# Altium schematic sheet RFFE-Supply-v2.SchDoc
size A3; SheetNumber: 3; SheetTotal: 3
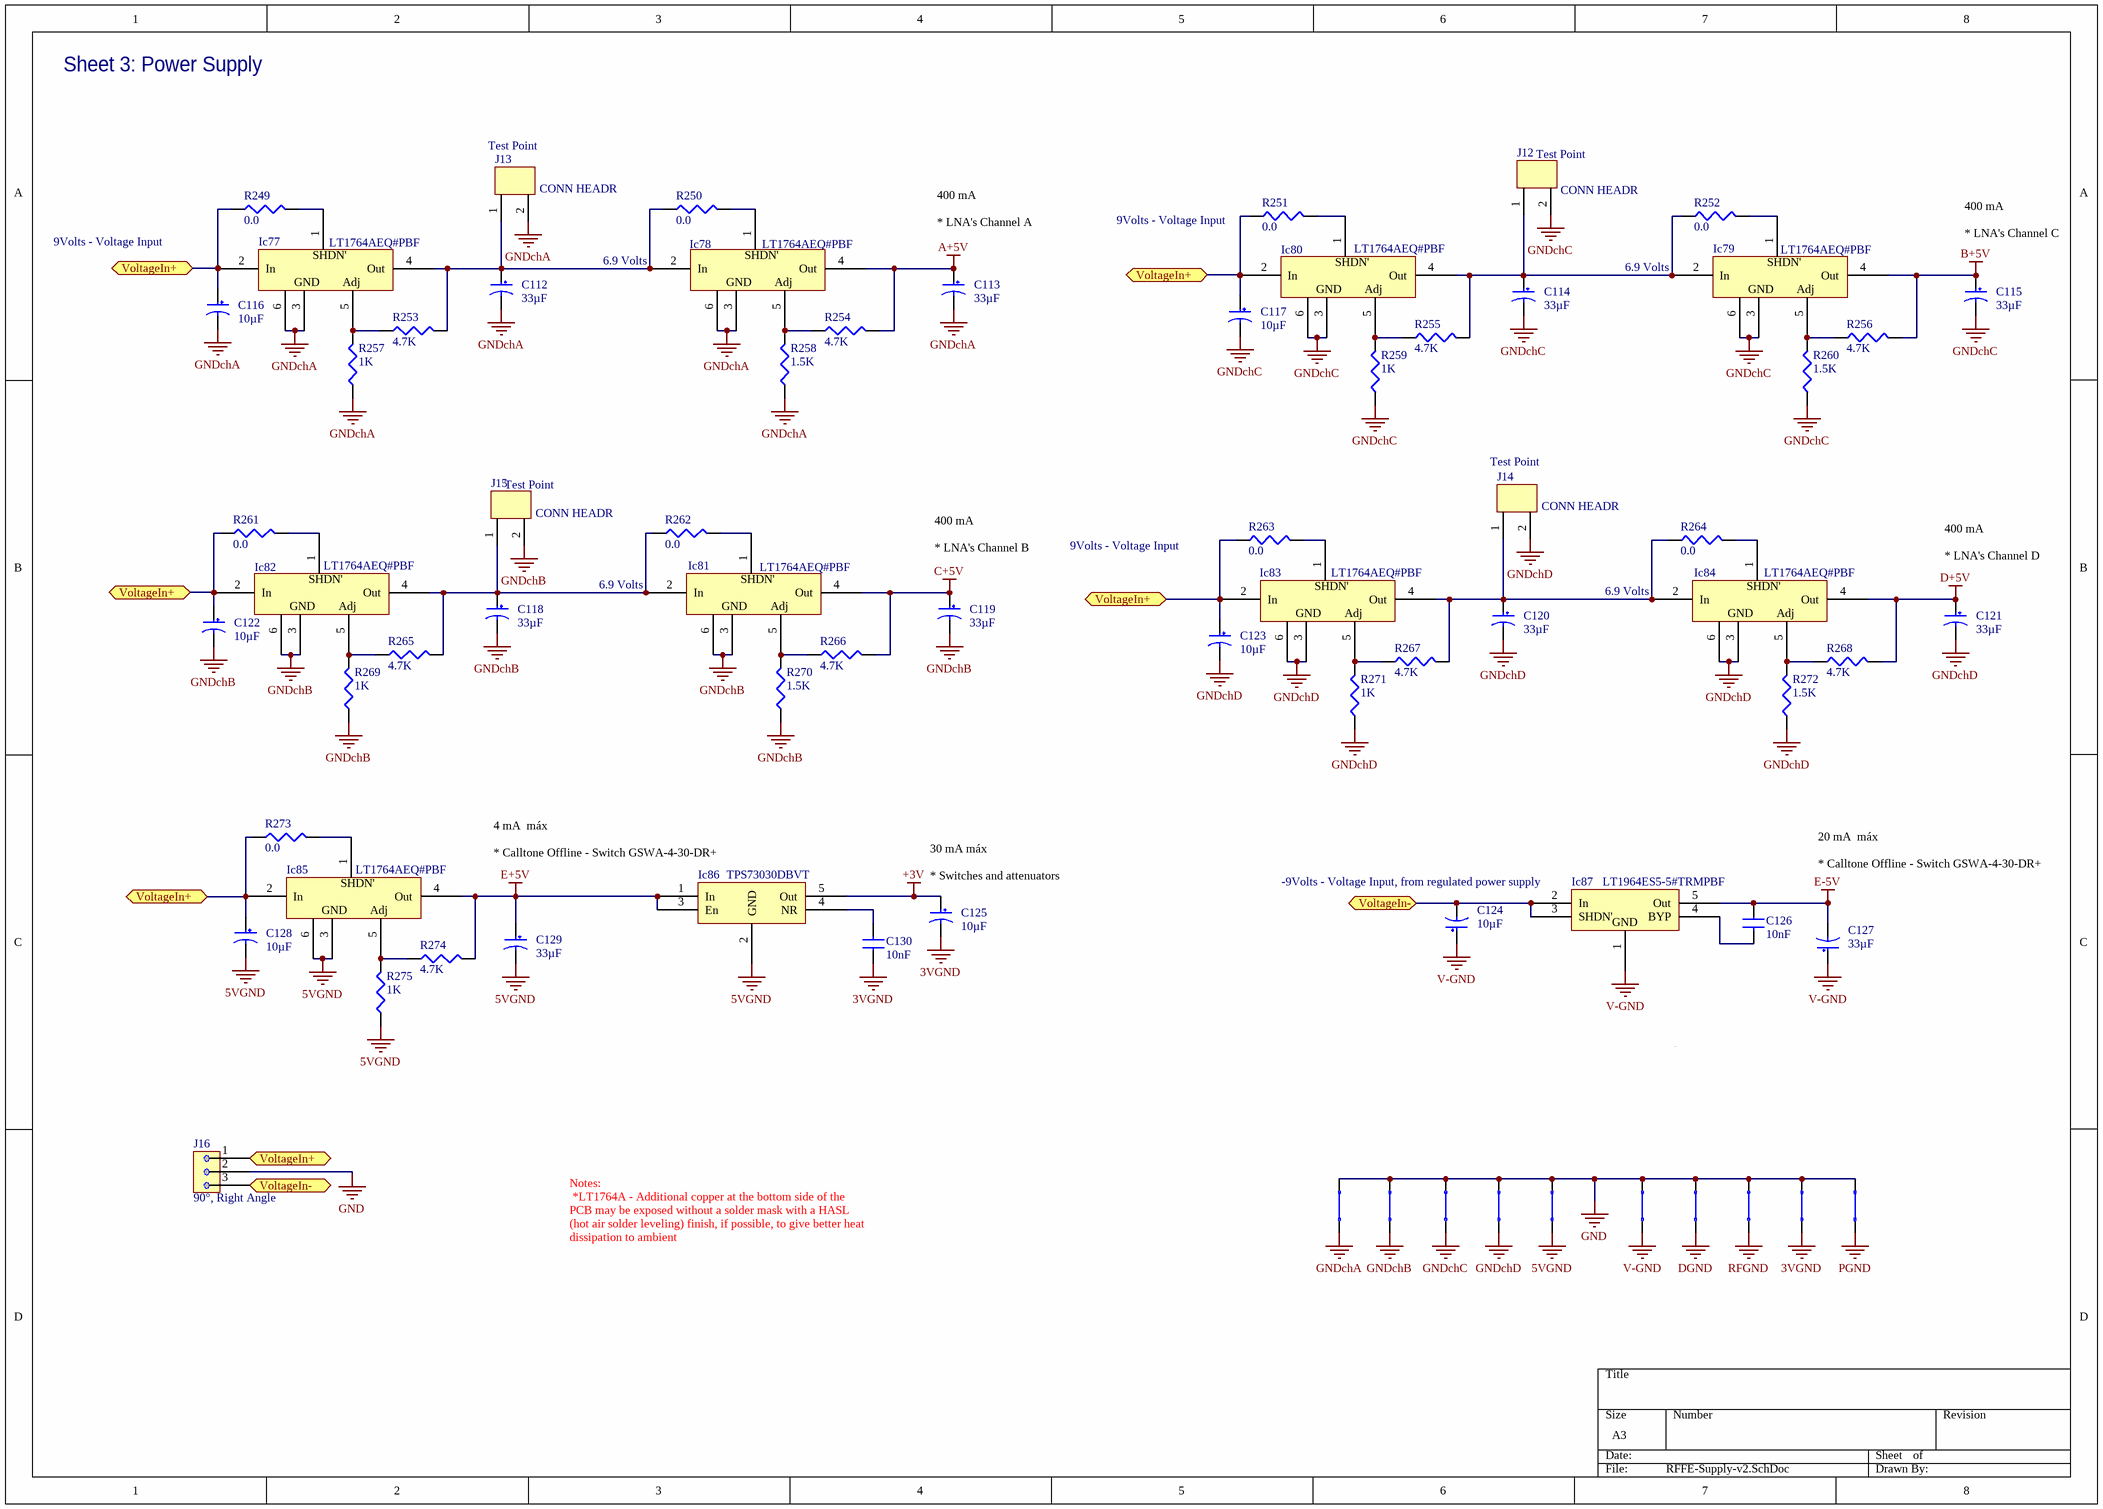
[diagram p0: RFFE-Supply-v2.SchDoc]

## Parts
C112  Capacitance: 33µF  [TC7343-2917]  (hidden comment: CAP TANT 33UF)
C113  Capacitance: 33µF  [TC7343-2917]  (hidden comment: CAP TANT 33UF)
C114  Capacitance: 33µF  [TC7343-2917]  (hidden comment: CAP TANT 33UF)
C115  Capacitance: 33µF  [TC7343-2917]  (hidden comment: CAP TANT 33UF)
C116  Capacitance: 10µF  [TC3528-1411]  (hidden comment: CAP TANT 10UF)
C117  Capacitance: 10µF  [TC3528-1411]  (hidden comment: CAP TANT 10UF)
C118  Capacitance: 33µF  [TC7343-2917]  (hidden comment: CAP TANT 33UF)
C119  Capacitance: 33µF  [TC7343-2917]  (hidden comment: CAP TANT 33UF)
C120  Capacitance: 33µF  [TC7343-2917]  (hidden comment: CAP TANT 33UF)
C121  Capacitance: 33µF  [TC7343-2917]  (hidden comment: CAP TANT 33UF)
C122  Capacitance: 10µF  [TC3528-1411]  (hidden comment: CAP TANT 10UF)
C123  Capacitance: 10µF  [TC3528-1411]  (hidden comment: CAP TANT 10UF)
C124  Capacitance: 10µF  [TC3528-1411]  (hidden comment: CAP TANT 10UF)
C125  Capacitance: 10µF  [TC3528-1411]  (hidden comment: CAP TANT 10UF)
C126  Capacitance: 10nF  [CAPC2012M]  (hidden comment: CAP CER 10000PF)
C127  Capacitance: 33µF  [TC7343-2917]  (hidden comment: CAP TANT 33UF)
C128  Capacitance: 10µF  [TC3528-1411]  (hidden comment: CAP TANT 10UF)
C129  Capacitance: 33µF  [TC7343-2917]  (hidden comment: CAP TANT 33UF)
C130  Capacitance: 10nF  [CAPC2012M]  (hidden comment: CAP CER 10000PF)
Ic77  IC LDO LO NOISE 3A ADJ DDPAK-5  [DD Pak]  (value not drawn)
Ic78  IC LDO LO NOISE 3A ADJ DDPAK-5  [DD Pak]  (value not drawn)
Ic79  IC LDO LO NOISE 3A ADJ DDPAK-5  [DD Pak]  (value not drawn)
Ic80  IC LDO LO NOISE 3A ADJ DDPAK-5  [DD Pak]  (value not drawn)
Ic81  IC LDO LO NOISE 3A ADJ DDPAK-5  [DD Pak]  (value not drawn)
Ic82  IC LDO LO NOISE 3A ADJ DDPAK-5  [DD Pak]  (value not drawn)
Ic83  IC LDO LO NOISE 3A ADJ DDPAK-5  [DD Pak]  (value not drawn)
Ic84  IC LDO LO NOISE 3A ADJ DDPAK-5  [DD Pak]  (value not drawn)
Ic85  IC LDO LO NOISE 3A ADJ DDPAK-5  [DD Pak]  (value not drawn)
Ic86  TPS73030DBVT  [DBV005]
Ic87  LT1964ES5-5#TRMPBF  [TSOT-23]
J12  CONN HEADR  [HDR1X2Ha]
J13  CONN HEADR  [HDR1X2H]
J14  CONN HEADR  [HDR1X2H]
J15  CONN HEADR  [HDR1X2H]
J16  Header Orientation: 90°, Right Angle  [Axial3]  (hidden comment: 1881451)
Jmp1  Jumper  [StrGND]  (value not drawn)
Jmp2  Jumper  [StrGND]  (value not drawn)
Jmp3  Jumper  [StrGND]  (value not drawn)
Jmp4  Jumper  [StrGND]  (value not drawn)
Jmp5  Jumper  [StrGND]  (value not drawn)
Jmp6  Jumper  [StrGND]  (value not drawn)
Jmp7  Jumper  [StrGND]  (value not drawn)
Jmp8  Jumper  [StrGND]  (value not drawn)
Jmp9  Jumper  [StrGND]  (value not drawn)
Jmp10  Jumper  [StrGND]  (value not drawn)
R249  Resistance (Ohms): 0.0  [CAPC1608N]  (hidden comment: ERJ-3GEY0R00V)
R250  Resistance (Ohms): 0.0  [CAPC1608N]  (hidden comment: ERJ-3GEY0R00V)
R251  Resistance (Ohms): 0.0  [CAPC1608N]  (hidden comment: ERJ-3GEY0R00V)
R252  Resistance (Ohms): 0.0  [CAPC1608N]  (hidden comment: ERJ-3GEY0R00V)
R253  Resistance (Ohms): 4.7K  [RESC2012N]  (hidden comment: RES 4.7K)
R254  Resistance (Ohms): 4.7K  [RESC2012N]  (hidden comment: RES 4.7K)
R255  Resistance (Ohms): 4.7K  [RESC2012N]  (hidden comment: RES 4.7K)
R256  Resistance (Ohms): 4.7K  [RESC2012N]  (hidden comment: RES 4.7K)
R257  Resistance (Ohms): 1K  [RESC2012M]  (hidden comment: RES 1.0K)
R258  Resistance (Ohms): 1.5K  [RESC2012M]  (hidden comment: RES 1.5K)
R259  Resistance (Ohms): 1K  [RESC2012M]  (hidden comment: RES 1.0K)
R260  Resistance (Ohms): 1.5K  [RESC2012M]  (hidden comment: RES 1.5K)
R261  Resistance (Ohms): 0.0  [CAPC1608N]  (hidden comment: ERJ-3GEY0R00V)
R262  Resistance (Ohms): 0.0  [CAPC1608N]  (hidden comment: ERJ-3GEY0R00V)
R263  Resistance (Ohms): 0.0  [CAPC1608N]  (hidden comment: ERJ-3GEY0R00V)
R264  Resistance (Ohms): 0.0  [CAPC1608N]  (hidden comment: ERJ-3GEY0R00V)
R265  Resistance (Ohms): 4.7K  [RESC2012N]  (hidden comment: RES 4.7K)
R266  Resistance (Ohms): 4.7K  [RESC2012N]  (hidden comment: RES 4.7K)
R267  Resistance (Ohms): 4.7K  [RESC2012N]  (hidden comment: RES 4.7K)
R268  Resistance (Ohms): 4.7K  [RESC2012N]  (hidden comment: RES 4.7K)
R269  Resistance (Ohms): 1K  [RESC2012M]  (hidden comment: RES 1.0K)
R270  Resistance (Ohms): 1.5K  [RESC2012M]  (hidden comment: RES 1.5K)
R271  Resistance (Ohms): 1K  [RESC2012M]  (hidden comment: RES 1.0K)
R272  Resistance (Ohms): 1.5K  [RESC2012M]  (hidden comment: RES 1.5K)
R273  Resistance (Ohms): 0.0  [CAPC1608N]  (hidden comment: ERJ-3GEY0R00V)
R274  Resistance (Ohms): 4.7K  [RESC2012N]  (hidden comment: RES 4.7K)
R275  Resistance (Ohms): 1K  [RESC2012M]  (hidden comment: RES 1.0K)

## Ports
VoltageIn+, VoltageIn-

## Nets
3VGND: C125.2 C130.2 Jmp7.1
5VGND: C128.2 C129.2 Ic85.3(GND) Ic85.6(GND) Ic86.2(GND) Jmp3.1 R275.2
+3V: C125.1 Ic86.5(Out)
A+5V: C113.1 Ic78.4(Out) R254.1
B+5V: C115.1 Ic79.4(Out) R256.1
C+5V: C119.1 Ic81.4(Out) R266.1
D+5V: C121.1 Ic84.4(Out) R268.1
DGND: Jmp5.1
E+5V: C129.1 Ic85.4(Out) Ic86.1(In) Ic86.3(En) R274.1
E-5V: C126.1 C127.2 Ic87.5(Out)
GND: J16.2(P2) Jmp1.2 Jmp2.2 Jmp3.2 Jmp4.2 Jmp5.2 Jmp6.2 Jmp7.2 Jmp8.2 Jmp9.2 Jmp10.2
GNDchA: C112.2 C113.2 C116.2 Ic77.3(GND) Ic77.6(GND) Ic78.3(GND) Ic78.6(GND) J13.2 Jmp9.1 R257.2 R258.2
GNDchB: C118.2 C119.2 C122.2 Ic81.3(GND) Ic81.6(GND) Ic82.3(GND) Ic82.6(GND) J15.2 Jmp10.1 R269.2 R270.2
GNDchC: C114.2 C115.2 C117.2 Ic79.3(GND) Ic79.6(GND) Ic80.3(GND) Ic80.6(GND) J12.2 Jmp1.1 R259.2 R260.2
GNDchD: C120.2 C121.2 C123.2 Ic83.3(GND) Ic83.6(GND) Ic84.3(GND) Ic84.6(GND) J14.2 Jmp2.1 R271.2 R272.2
PGND: Jmp8.1
RFGND: Jmp6.1
V-GND: C124.1 C127.1 Ic87.1(GND) Jmp4.1
VoltageIn+: C116.1 C117.1 C122.1 C123.1 C128.1 Ic77.2(In) Ic80.2(In) Ic82.2(In) Ic83.2(In) Ic85.2(In) J16.1(P1) R249.2 R251.2 R261.2 R263.2 R273.2 ; port VoltageIn+
VoltageIn-: C124.2 Ic87.2(In) Ic87.3(SHDN') J16.3(P3) ; port VoltageIn-
NetC112_1: C112.1 Ic77.4(Out) Ic78.2(In) J13.1 R250.2 R253.1
NetC114_1: C114.1 Ic79.2(In) Ic80.4(Out) J12.1 R252.2 R255.1
NetC118_1: C118.1 Ic81.2(In) Ic82.4(Out) J15.1 R262.2 R265.1
NetC120_1: C120.1 Ic83.4(Out) Ic84.2(In) J14.1 R264.2 R267.1
NetC126_2: C126.2 Ic87.4(BYP)
NetC130_1: C130.1 Ic86.4(NR)
NetIc77_1: Ic77.1(SHDN) R249.1
NetIc77_5: Ic77.5(Adj) R253.2 R257.1
NetIc78_1: Ic78.1(SHDN) R250.1
NetIc78_5: Ic78.5(Adj) R254.2 R258.1
NetIc79_1: Ic79.1(SHDN) R252.1
NetIc79_5: Ic79.5(Adj) R256.2 R260.1
NetIc80_1: Ic80.1(SHDN) R251.1
NetIc80_5: Ic80.5(Adj) R255.2 R259.1
NetIc81_1: Ic81.1(SHDN) R262.1
NetIc81_5: Ic81.5(Adj) R266.2 R270.1
NetIc82_1: Ic82.1(SHDN) R261.1
NetIc82_5: Ic82.5(Adj) R265.2 R269.1
NetIc83_1: Ic83.1(SHDN) R263.1
NetIc83_5: Ic83.5(Adj) R267.2 R271.1
NetIc84_1: Ic84.1(SHDN) R264.1
NetIc84_5: Ic84.5(Adj) R268.2 R272.1
NetIc85_1: Ic85.1(SHDN) R273.1
NetIc85_5: Ic85.5(Adj) R274.2 R275.1

## Notes on the sheet
- Sheet 3: Power Supply
- (near J13) Test Point
- (near J12) Test Point
- 9Volts - Voltage Input
- (near C113) 400 mA
  * LNA's Channel A
- (near R251) 9Volts - Voltage Input
- (near C115) 400 mA
  * LNA's Channel C
- 6.9 Volts
- (near J15) Test Point
- (near J14) Test Point
- (near C119) 400 mA
  * LNA's Channel B
- (near C121) 400 mA
  * LNA's Channel D
- (near Ic86) 4 mA  máx
  * Calltone Offline - Switch GSWA-4-30-DR+
- (near C125) 30 mA máx
  * Switches and attenuators
- (near Ic87) -9Volts - Voltage Input, from regulated power supply
- 20 mA  máx
  * Calltone Offline - Switch GSWA-4-30-DR+
- Notes:
  *LT1764A - Additional copper at the bottom side of the PCB may be exposed without a solder mask with a HASL (hot air solder leveling) finish, if possible, to give better heat dissipation to ambient
- (in symbol LT1764AEQ#PBF) SHDN'

## Library data of the parts
C112-C115 C118-C121 C127 C129 = T495D336K016ATE150: CAP TANT 33UF 16V 10% 2917; Manufacturer: Kemet; Manufacturer Size Code: D; ESR (Equivalent Series Resistance): 150.0 mOhm; Type: Molded; Supplier 1: Digi-Key; Manufacturer Part Number: T495D336K016ATE150; RoHS: RoHS Compliant; Category: Capacitors; Stock 1: 9591; Pricing 1: 1=2.12, 10=1.735, 25=1.566, 100=1.3966, 250=1.22728 (USD); Voltage - Rated: 16V; Tolerance: ±10%; Operating Temperature: -55°C ~ 125°C; Mounting Type: Surface Mount; Package / Case: 2917 (7343 Metric); Size / Dimension: 0.287" L x 0.169" W (7.30mm x 4.30mm); Height - Seated (Max): 0.122" (3.10mm); Lead Spacing: -; Features: General Purpose; Packaging: Cut Tape (CT); Lifetime @ Temp.: -; ComponentLink1URL: http://www.kemet.com/datasheets&T495D336K016ATE150; ComponentLink1Description: http://www.kemet.com/datasheets&T495D336K016ATE150; Supplier Part Number 1: 399-4702-1-ND
C116 C117 C122-C125 C128 = T520B106M016ATE100: CAP TANT 10UF 16V 20% 1411; Manufacturer: Kemet; Manufacturer Size Code: B; ESR (Equivalent Series Resistance): 100.0 mOhm; Type: Molded; Supplier 1: Digi-Key; Manufacturer Part Number: T520B106M016ATE100; RoHS: RoHS Compliant; Category: Capacitors; Stock 1: 209; Pricing 1: 1=1.5, 10=1.23, 25=1.11, 100=0.99, 250=0.87, 500=0.81, 1000=0.63 (USD); Voltage - Rated: 16V; Tolerance: ±20%; Operating Temperature: -55°C ~ 105°C; Mounting Type: Surface Mount; Package / Case: 1411 (3528 Metric); Size / Dimension: 0.138" L x 0.110" W (3.50mm x 2.80mm); Height - Seated (Max): 0.083" (2.10mm); Lead Spacing: -; Features: Polymer; Packaging: Cut Tape (CT); Lifetime @ Temp.: -; ComponentLink1URL: http://www.kemet.com/datasheets&T520B106M016ATE100; ComponentLink1Description: http://www.kemet.com/datasheets&T520B106M016ATE100; Supplier Part Number 1: 399-5483-1-ND
C126 C130 = C2012C0G1H103J/0.60: CAP CER 10000PF 50V 5% NP0 0805; Manufacturer: TDK Corporation; Temperature Coefficient: C0G, NP0; Supplier 1: Digi-Key; Manufacturer Part Number: C2012C0G1H103J/0.60; RoHS: RoHS Compliant; Category: Capacitors; Stock 1: 7053; Pricing 1: 1=0.46, 10=0.363, 100=0.1898, 250=0.14024, 500=0.1089, 1000=0.0858 (USD); Voltage - Rated: 50V; Tolerance: ±5%; Mounting Type: Surface Mount, MLCC; Operating Temperature: -55°C ~ 125°C; Applications: General Purpose; Ratings: -; Package / Case: 0805 (2012 Metric); Size / Dimension: 0.079" L x 0.049" W (2.00mm x 1.25mm); Height - Seated (Max): -; Thickness (Max): 0.028" (0.70mm); Lead Spacing: -; Features: -; Packaging: Cut Tape (CT); Lead Style: -; ComponentLink1URL: http://www.tdk.com/pdf/general_B11.pdf; ComponentLink1Description: http://www.tdk.com/pdf/general_B11.pdf; Supplier Part Number 1: 445-7519-1-ND
Ic77-Ic85 = LT1764AEQ#PBF: Manufacturer: Linear Technology; Regulator Topology: Positive Adjustable; Voltage - Output: 1.21 V ~ 20 V; Voltage - Input: 2.7 V ~ 20 V; Voltage - Dropout (Typical): 0.34V @ 3A; Number of Regulators: 1; Current - Limit (Min): 3.1A; Supplier 1: Digi-Key; RoHS: RoHS Compliant; Description: IC LDO LO NOISE 3A ADJ DDPAK-5; Category: Integrated Circuits (ICs); Stock 1: 4102; Pricing 1: 1=7.38, 25=5.09, 100=4.19 (USD); Current - Output: 3A; Operating Temperature: -40°C ~ 125°C; Mounting Type: Surface Mount; Package / Case: TO-263-6, D²Pak (5 Leads + Tab), TO-263BA; Supplier Device Package: D2PAK-5; Packaging: Tube; ComponentLink1URL: http://www.linear.com/docs/1316; ComponentLink1Description: http://www.linear.com/docs/1316; Supplier Part Number 1: LT1764AEQ#PBF-ND; Manufacturer Part Number: LT1764AEQ#PBF
Ic86 = TPS73030DBVT: IC LDO REG HI-PSRR 3V SOT23-5; Manufacturer: Texas Instruments; Regulator Topology: Positive Fixed; Voltage - Input: Up to 5.5V; Voltage - Dropout (Typical): 0.12V @ 200mA; Number of Regulators: 1; Current - Output: 200mA (Max); Current - Limit (Min): 285mA; Supplier 1: Digi-Key; RoHS: RoHS Compliant; Category: Integrated Circuits (ICs); Stock 1: 572; Pricing 1: 1=0.84, 10=0.733, 25=0.6476, 100=0.5643 (USD); Voltage - Output: 3V; Operating Temperature: -40°C ~ 125°C; Mounting Type: Surface Mount; Package / Case: SC-74A, SOT-753; Supplier Device Package: SOT-23-5; Packaging: Cut Tape (CT); ComponentLink1URL: http://www.ti.com/lit/ds/symlink/tps73001.pdf; ComponentLink1Description: http://www.ti.com/lit/ds/symlink/tps73001.pdf; Supplier Part Number 1: 296-17579-1-ND; Manufacturer Part Number: TPS73030DBVT
Ic87 = LT1964ES5-5#TRMPBF: IC LDO REG NEG LOWNOISE TSOT23-5; Manufacturer: Linear Technology; Regulator Topology: Negative Fixed; Voltage - Output: -5V; Voltage - Input: Up to 20V; Voltage - Dropout (Typical): 0.34V @ 200mA; Number of Regulators: 1; Current - Output: 200mA; Current - Limit (Min): 220mA; Supplier 1: Digi-Key; RoHS: RoHS Compliant; Category: Integrated Circuits (ICs); Stock 1: 5556; Pricing 1: 1=3.25, 25=2.9, 100=2.61 (USD); Operating Temperature: -40°C ~ 125°C; Mounting Type: Surface Mount; Package / Case: SOT-23-5 Thin, TSOT-23-5; Supplier Device Package: TSOT-23-5; Packaging: Cut Tape (CT); ComponentLink1URL: http://www.linear.com/docs/1258; ComponentLink1Description: http://www.linear.com/docs/1258; Supplier Part Number 1: LT1964ES5-5#TRMPBFCT-ND; Manufacturer Part Number: LT1964ES5-5#TRMPBF
J12-J15 = 4-103321-4: CONN HEADR BRKWAY .100 2POS STR; Manufacturer: TE Connectivity; Connector Type: Header, Unshrouded, Breakaway; Number of Positions: 2; Number of Positions Loaded: All; Pitch: 0.100" (2.54mm); Supplier 1: Digi-Key; Manufacturer Part Number: 4-103321-4; RoHS: RoHS non-compliant; Category: Connectors, Interconnects; Stock 1: 0; Pricing 1: 20000=0.07434 (USD); Contact Type: Male Pin; Number of Rows: 1; Row Spacing: -; Contact Mating Length: 0.318" (8.08mm); Mounting Type: Through Hole; Termination: Solder; Fastening Type: -; Features: -; Contact Finish: Tin; Contact Finish Thickness: 100µin (2.54µm); Color: Black; Packaging: Bulk; ComponentLink1URL: http://documents.tycoelectronics.com/commerce/DocumentDelivery/DDEController?Action=srchrtrv&DocNm=103321&DocType=CD&DocLang=EN; ComponentLink1Description: http://documents.tycoelectronics.com/commerce/DocumentDelivery/DDEController?Action=srchrtrv&DocNm=103321&DocType=CD&DocLang=EN; Supplier Part Number 1: 4-103321-4-ND
J16 = 1881451: CONN TERM BLK HDR 2.5MM 3POS; Manufacturer: Phoenix Contact; Positions Per Level: 3; Pitch: 0.098" (2.50mm); Number of Levels: 1; Current: 4A; Voltage: 125V; Supplier 1: Digi-Key; Manufacturer Part Number: 1881451; RoHS: RoHS Compliant; Category: Connectors, Interconnects; Stock 1: 691; Pricing 1: 1=1.13, 10=1.098, 50=1.026, 100=0.9439, 250=0.87212, 500=0.83106, 1000=0.77976 (USD); Terminal Block Type: Header, Male Pins, Shrouded (4 Side); Plug Wire Entry: -; Termination: Solder; Wire Gauge: -; Mounting Type: Through Hole; Features: -; Color: Green; Packaging: Bulk; ComponentLink1URL: http://media.digikey.com/pdf/Data%20Sheets/Phoenix%20Contact%20PDFs/1881451.pdf; ComponentLink1Description: http://media.digikey.com/pdf/Data%20Sheets/Phoenix%20Contact%20PDFs/1881451.pdf; Supplier Part Number 1: 277-1442-ND
R249-R252 R261-R264 R273 = ERJ-3GEY0R00V: RES 0.0 OHM 1/10W 0603 SMD; Manufacturer: Panasonic - ECG; Power (Watts): 0.1W, 1/10W; Tolerance: Jumper; Supplier 1: Digi-Key; Manufacturer Part Number: ERJ-3GEY0R00V; RoHS: RoHS Compliant; Category: Resistors; Stock 1: 12033013; Pricing 1: 1=0.02, 50=0.0092, 100=0.007, 250=0.0052, 500=0.00384, 1000=0.00256 (USD); Composition: Thick Film; Features: -; Temperature Coefficient: -; Package / Case: 0603 (1608 Metric); Size / Dimension: 0.063" L x 0.031" W (1.60mm x 0.80mm); Height: 0.022" (0.55mm); Number of Terminations: 2; Packaging: Cut Tape (CT); ComponentLink1URL: http://industrial.panasonic.com/www-cgi/jvcr13pz.cgi?E+PZ+3+AOA0001+ERJ3GEY0R00V+7+WW; ComponentLink1Description: http://industrial.panasonic.com/www-cgi/jvcr13pz.cgi?E+PZ+3+AOA0001+ERJ3GEY0R00V+7+WW; Supplier Part Number 1: P0.0GCT-ND
R253-R256 R265-R268 R274 = ERA-6AEB472V: RES 4.7K OHM 1/8W .1% 0805 SMD; Manufacturer: Panasonic - ECG; Power (Watts): 0.125W, 1/8W; Temperature Coefficient: ±25ppm/°C; Tolerance: ±0.1%; Supplier 1: Digi-Key; Manufacturer Part Number: ERA-6AEB472V; RoHS: RoHS Compliant; Category: Resistors; Stock 1: 33491; Pricing 1: 1=0.51, 50=0.1996, 100=0.1603, 250=0.12468, 500=0.09406, 1000=0.07268 (USD); Composition: Thin Film; Features: -; Package / Case: 0805 (2012 Metric); Size / Dimension: 0.079" L x 0.049" W (2.00mm x 1.25mm); Height: 0.024" (0.60mm); Number of Terminations: 2; Packaging: Cut Tape (CT); ComponentLink1URL: http://industrial.panasonic.com/www-cgi/jvcr13pz.cgi?E+PZ+3+AOA0026+ERA6AEB472V+7+WW; ComponentLink1Description: http://industrial.panasonic.com/www-cgi/jvcr13pz.cgi?E+PZ+3+AOA0026+ERA6AEB472V+7+WW; Supplier Part Number 1: P4.7KDACT-ND
R257 R259 R269 R271 R275 = ERA-6AEB102V: RES 1.0K OHM 1/8W .1% 0805 SMD; Manufacturer: Panasonic - ECG; Power (Watts): 0.125W, 1/8W; Temperature Coefficient: ±25ppm/°C; Tolerance: ±0.1%; Supplier 1: Digi-Key; Manufacturer Part Number: ERA-6AEB102V; RoHS: RoHS Compliant; Category: Resistors; Stock 1: 336451; Pricing 1: 1=0.51, 50=0.1996, 100=0.1603, 250=0.12468, 500=0.09406, 1000=0.07268 (USD); Composition: Thin Film; Features: -; Package / Case: 0805 (2012 Metric); Size / Dimension: 0.079" L x 0.049" W (2.00mm x 1.25mm); Height: 0.024" (0.60mm); Number of Terminations: 2; Packaging: Cut Tape (CT); ComponentLink1URL: http://industrial.panasonic.com/www-cgi/jvcr13pz.cgi?E+PZ+3+AOA0026+ERA6AEB102V+7+WW; ComponentLink1Description: http://industrial.panasonic.com/www-cgi/jvcr13pz.cgi?E+PZ+3+AOA0026+ERA6AEB102V+7+WW; Supplier Part Number 1: P1.0KDACT-ND
R258 R260 R270 R272 = ERA-6AEB152V: RES 1.5K OHM 1/8W .1% 0805 SMD; Manufacturer: Panasonic - ECG; Power (Watts): 0.125W, 1/8W; Temperature Coefficient: ±25ppm/°C; Tolerance: ±0.1%; Supplier 1: Digi-Key; Manufacturer Part Number: ERA-6AEB152V; RoHS: RoHS Compliant; Category: Resistors; Stock 1: 52069; Pricing 1: 1=0.51, 50=0.1996, 100=0.1603, 250=0.12468, 500=0.09406, 1000=0.07268 (USD); Composition: Thin Film; Features: -; Package / Case: 0805 (2012 Metric); Size / Dimension: 0.079" L x 0.049" W (2.00mm x 1.25mm); Height: 0.024" (0.60mm); Number of Terminations: 2; Packaging: Cut Tape (CT); ComponentLink1URL: http://industrial.panasonic.com/www-cgi/jvcr13pz.cgi?E+PZ+3+AOA0026+ERA6AEB152V+7+WW; ComponentLink1Description: http://industrial.panasonic.com/www-cgi/jvcr13pz.cgi?E+PZ+3+AOA0026+ERA6AEB152V+7+WW; Supplier Part Number 1: P1.5KDACT-ND